# Altium schematic sheet 计算机原理课程设计2.SchDoc
size A4
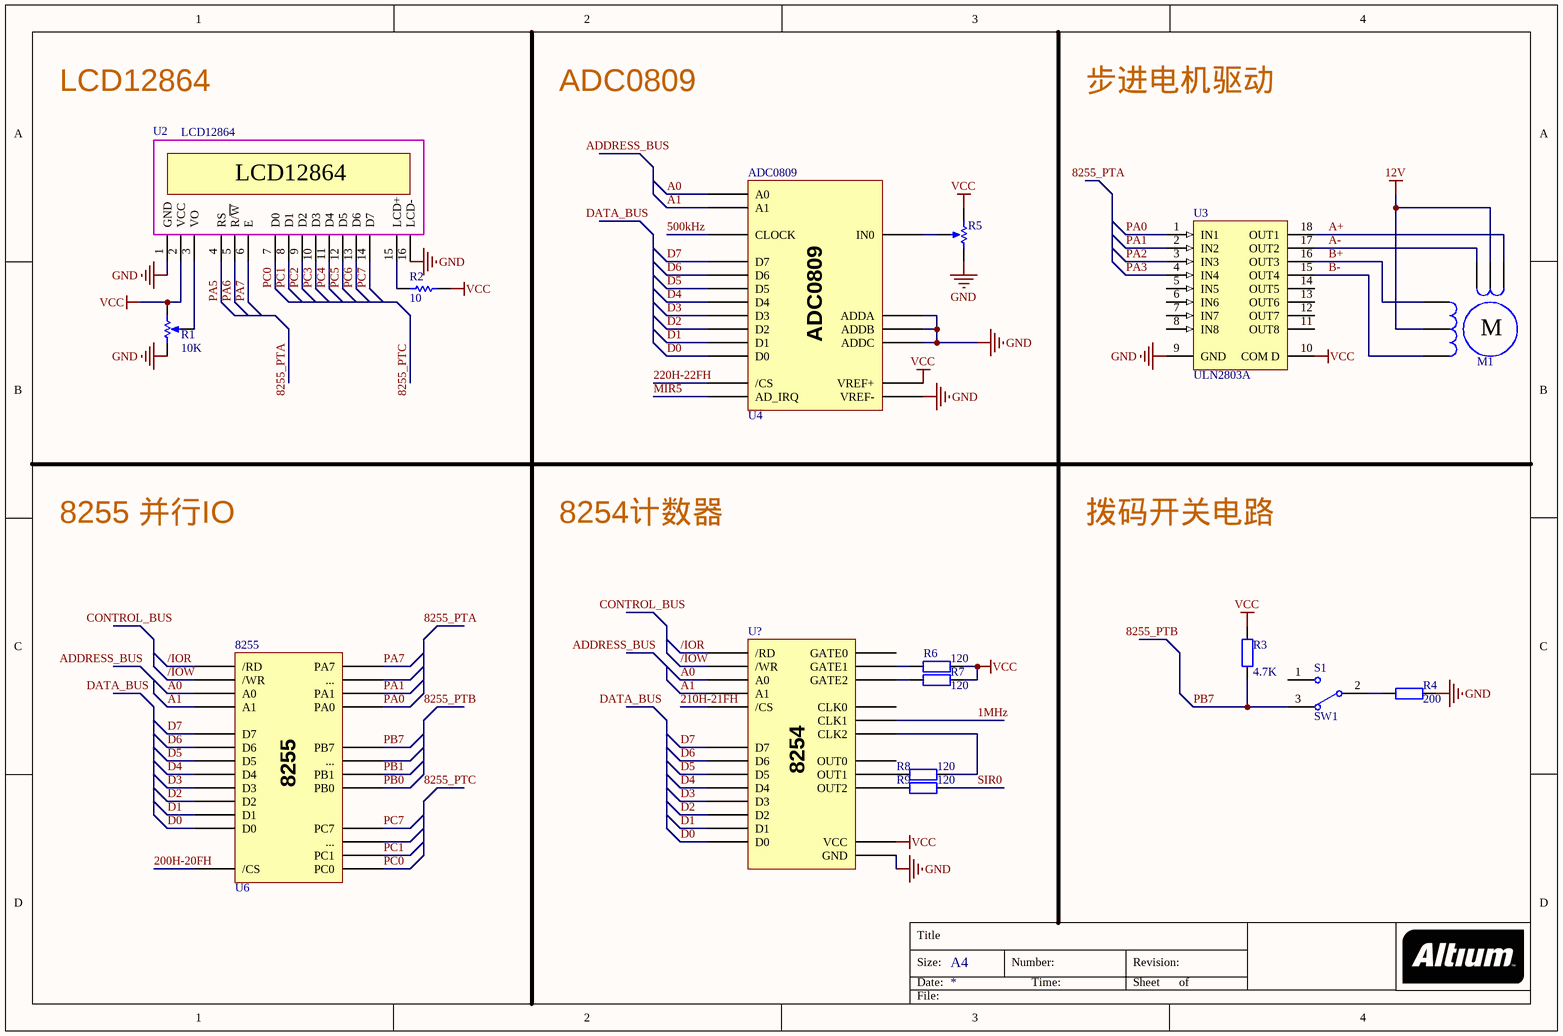
[diagram p0: 计算机原理课程设计2.SchDoc]

## Parts
8255  U6
ADC0809  U4
M1  MOTOR STEPPER  (value not drawn)
R1  value 10K  [VR5]  (hidden comment: RPot)
R2  value 10  [AXIAL-0.3]  (hidden comment: Res1)
R3  value 4.7K  [AXIAL-0.4]  (hidden comment: Res2)
R4  value 200  [AXIAL-0.4]  (hidden comment: Res2)
R5  RPot  [VR5]  (value not drawn)
R6  value 120  [AXIAL-0.4]  (hidden comment: Res2)
R7  value 120  [AXIAL-0.4]  (hidden comment: Res2)
R8  value 120  [AXIAL-0.4]  (hidden comment: Res2)
R9  value 120  [AXIAL-0.4]  (hidden comment: Res2)
S1  SW1  [TL36WW15050]
U2  LCD12864  [LCD1602]
U3  ULN2803A  [A18]
U?  8253A  (value not drawn)

## Nets
12V: M1.2 M1.5
GND: ADC0809.GND(ADDA) R1.1(TOP) R4.1 R5.2(BOT) U2.1(GND) U2.16(LCD-) U3.9(GND) U?.GND
VCC: ADC0809.GND(VREF+) R1.2(BOT) R2.1 R3.2 R5.1(TOP) R6.2 R7.2 U2.2(VCC) U3.10(COM_D) U?.GND(VCC)
1MHz: U?.GND(CLK1)
200H-20FH: 8255.GND(/CS)
210H-21FH: U?.GND(/CS)
220H-22FH: ADC0809.GND(/CS)
500kHz: ADC0809.GND(CLOCK)
/IOR: 8255.GND(/RD) U?.GND(/RD)
/IOW: 8255.GND(/WR) U?.GND(/WR)
A0: 8255.GND(A0) ADC0809.GND(A0) U?.GND(A0)
A1: 8255.GND(A1) ADC0809.GND(A1) U?.GND(A1)
A+: M1.1 U3.18(OUT1)
A-: M1.3 U3.17(OUT2)
B+: M1.4 U3.16(OUT3)
B-: M1.6 U3.15(OUT4)
D0: 8255.GND(D0) ADC0809.GND(D0) U?.GND(D0)
D1: 8255.GND(D1) ADC0809.GND(D1) U?.GND(D1)
D2: 8255.GND(D2) ADC0809.GND(D2) U?.GND(D2)
D3: 8255.GND(D3) ADC0809.GND(D3) U?.GND(D3)
D4: 8255.GND(D4) ADC0809.GND(D4) U?.GND(D4)
D5: 8255.GND(D5) ADC0809.GND(D5) U?.GND(D5)
D6: 8255.GND(D6) ADC0809.GND(D6) U?.GND(D6)
D7: 8255.GND(D7) ADC0809.GND(D7) U?.GND(D7)
MIR5: ADC0809.GND(AD_IRQ)
PA0: 8255.GND(PA0) U3.1(IN1)
PA1: 8255.GND(PA1) U3.2(IN2)
PA2: U3.3(IN3)
PA3: U3.4(IN4)
PA5: U2.4(RS)
PA6: U2.5(R/~{W})
PA7: 8255.GND(PA7) U2.6(E)
PB0: 8255.GND(PB0)
PB1: 8255.GND(PB1)
PB7: 8255.GND(PB7) R3.1 S1.3
PC0: 8255.GND(PC0) U2.7(D0)
PC1: 8255.GND(PC1) U2.8(D1)
PC2: U2.9(D2)
PC3: U2.10(D3)
PC4: U2.11(D4)
PC5: U2.12(D5)
PC6: U2.13(D6)
PC7: 8255.GND(PC7) U2.14(D7)
SIR0: R9.2
NetADC0809_GND: ADC0809.GND(IN0) R5.3(TAP)
NetR1_3: R1.3(TAP) U2.3(VO)
NetR2_2: R2.2 U2.15(LCD+)
NetR4_2: R4.2 S1.2
NetR6_1: R6.1 U?.GND(GATE1)
NetR7_1: R7.1 U?.GND(GATE2)
NetR8_1: R8.1 U?.GND(OUT1)
NetR8_2: R8.2 U?.GND(CLK2)
NetR9_1: R9.1 U?.GND(OUT2)

Not connected (* = marked no-connect by the designer): S1 1; U3 5(IN5) 6(IN6) 7(IN7) 8(IN8) 11(OUT8) 12(OUT7) 13(OUT6) 14(OUT5)

## Notes on the sheet
- LCD12864
- ADC0809
- 步进电机驱动
- (near U2) LCD12864
- (near M1) M
- 8255 并行IO
- 8254计数器
- 拨码开关电路
- Labels drawn without touching a wire or pin: 8255_PTA, 8255_PTB, 8255_PTC, ADDRESS_BUS, CONTROL_BUS, DATA_BUS
- Title
- Size:
- Date:
- A4
- Number:
- Time:
- Revision:
- Sheet
- of
- File:
- (in symbol 8253A) 8254

## Library data of the parts
8255 = 8255
ADC0809 = ADC0809
R1 = RPot: Potentiometer; Sim Note: Enter the Resistance value and the set point into parameter fields.; Set Position: 0.5; Published: 8-Jun-2000; LatestRevisionDate: 17-Jul-2002; LatestRevisionNote: Re-released for DXP Platform.; PackageReference: VR5; Publisher: Altium Limited; PackageDescription: Variable Resistor, Thru-Hole; 3 Leads
R2 = Res1: Resistor; Published: 8-Jun-2000; LatestRevisionDate: 17-Jul-2002; LatestRevisionNote: Re-released for DXP Platform.; PackageReference: AXIAL-0.3; Publisher: Altium Limited; PackageDescription: Axial Device, Thru-Hole; 2 Leads; 0.3 in Pin Spacing
R3 R4 R6-R9 = Res2: Resistor; Published: 8-Jun-2000; LatestRevisionDate: 17-Jul-2002; LatestRevisionNote: Re-released for DXP Platform.; PackageReference: AXIAL-0.4; Publisher: Altium Limited; PackageDescription: Axial Device, Thru-Hole; 2 Leads; 0.4 in Pin Spacing
R5 = RPot: Potentiometer; Sim Note: Enter the Resistance value and the set point into parameter fields.; Set Position: 0.5; Value: 10K; Published: 8-Jun-2000; LatestRevisionDate: 17-Jul-2002; LatestRevisionNote: Re-released for DXP Platform.; PackageReference: VR5; Publisher: Altium Limited; PackageDescription: Variable Resistor, Thru-Hole; 3 Leads
S1 = SW-SPDT: SPDT Subminiature Toggle Switch, Right Angle Mounting, Vertical Actuation; Published: 24-Mar-1999; LatestRevisionDate: 17-Dec-2003; LatestRevisionNote: Schematic revised, PCB Footprint replaced.; DatasheetVersion: 05-Dec-2000; PackageReference: TL36WW15050; Publisher: Altium Limited; PackageDescription: Switch; 4 Leads; ComponentLink1Description: Manufacturer Link; ComponentLink1URL: http://www.apem.com
U2 = LCD1602
U3 = ULN2803A: High-Voltage, High-Current Darlington Array; Published: 13-Oct-2000; LatestRevisionDate: 06-Jun-2005; LatestRevisionNote: Stylized 3D Model Added.; DatasheetVersion: 1999; PackageVersion: 1999; PackageReference: A18; Publisher: Altium Limited; PackageDescription: DIP; 18 Leads; Row Spacing 7.62 mm; Pitch 2.54 mm; ComponentLink1Description: Manufacturer Link; ComponentLink1URL: http://www.allegromicro.com/